# Altium project Humidity_Remover.PrjPcb
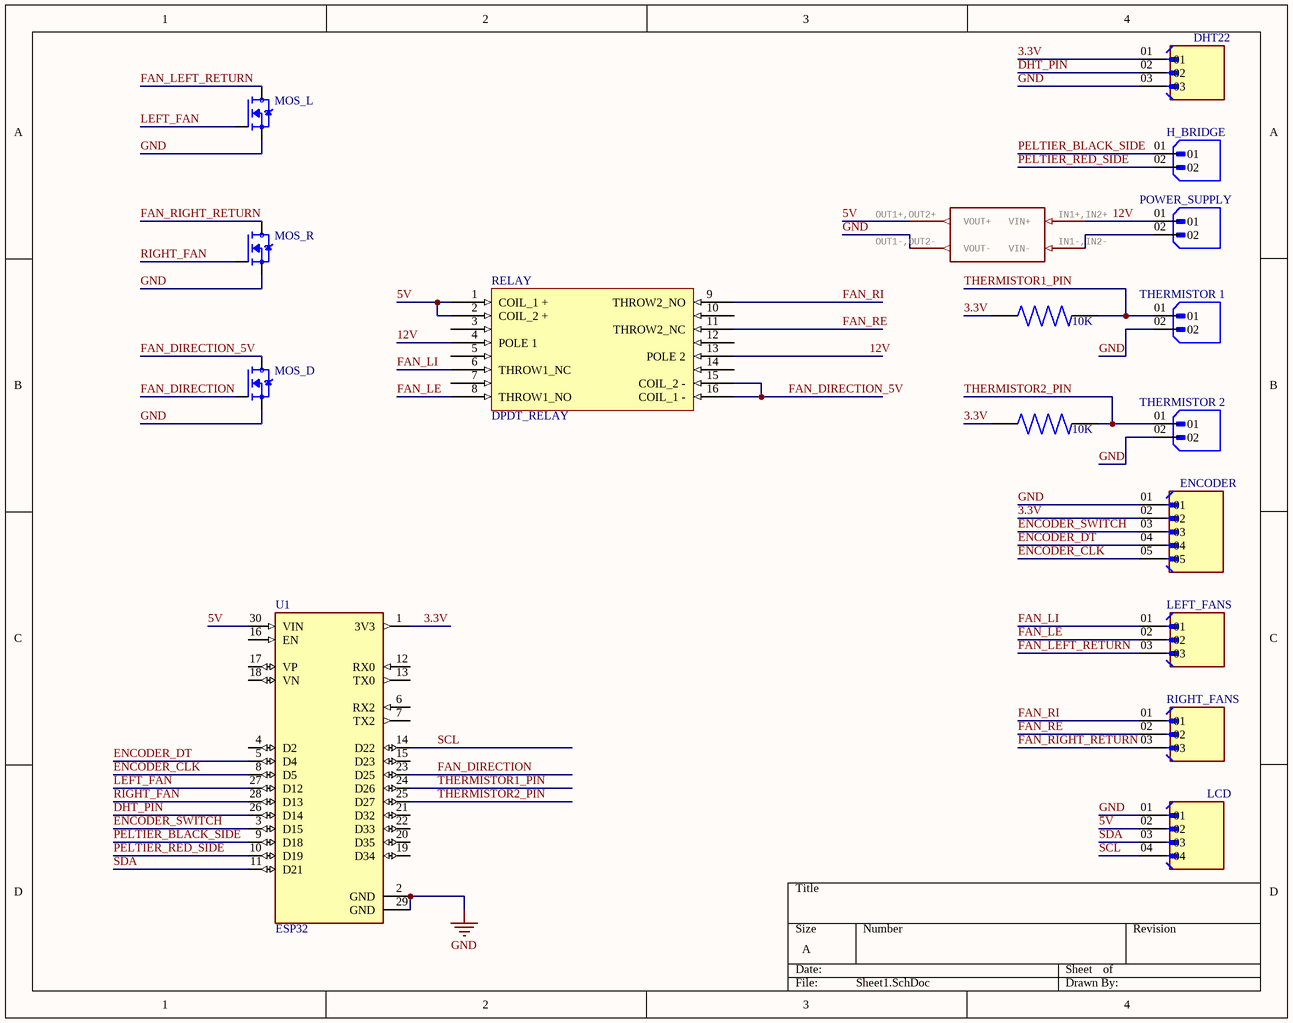
[diagram p0: Sheet1.SchDoc]
1 sheet, 17 parts. Net scope: global (net labels, ports and power ports of the same name join across sheets).

## Sheet Sheet1.SchDoc
size A; SheetNumber: 1; SheetTotal: 1

### Parts
(Parts that share a designator on the sheet are numbered #1, #2 ... from top to bottom, then left to right.)
10K#1  MFR-25FBF52-10K  [RESAD1100W55L680D260]  (value not drawn)
10K#2  10K  [RESAD1100W55L680D260]  (value not drawn)
DHT22  XH250-03S-010  [VALCON_XH250-03S-010]  (value not drawn)
ENCODER  XH250-05S-010  [VALCON_XH250-05S-010]  (value not drawn)
H_BRIDGE  XH250-02S-010  [VALCON_XH250-02S-010]  (value not drawn)
LCD  XH250-04S-010  [VALCON_XH250-04S-010]  (value not drawn)
LEFT_FANS  XH250-03S-010  [VALCON_XH250-03S-010]  (value not drawn)
MOS_D  IRLZ44N  [TO254P1054X469X1930-3]  (value not drawn)
MOS_L  IRLZ44N  [TO254P1054X469X1930-3]  (value not drawn)
MOS_R  IRLZ44N  [TO254P1054X469X1930-3]  (value not drawn)
MP1854  MP1584-dc-brick-pcb Step down Input: 4.5V - 28V Ouput 0.8V - 25V max. 3A Cheap on ebay  [DC-BRICK]  (value not drawn)
POWER_SUPPLY  XH250-02S-010  [VALCON_XH250-02S-010]  (value not drawn)
RELAY  DPDT_RELAY  [RELAY-2S]
RIGHT_FANS  XH250-03S-010  [VALCON_XH250-03S-010]  (value not drawn)
THERMISTOR_1  XH250-02S-010  [VALCON_XH250-02S-010]  (value not drawn)
THERMISTOR_2  XH250-02S-010  [VALCON_XH250-02S-010]  (value not drawn)
U1  ESP32  [MODULE_ESP32_DEVKIT_V1]

### Nets
GND: DHT22.03 ENCODER.01 LCD.01 MOS_D.3(S) MOS_L.3(S) MOS_R.3(S) MP1854.OUT1-,OUT2-(VOUT-) THERMISTOR_1.02 THERMISTOR_2.02 U1.2(GND) U1.29(GND)
3.3V: 10K#1.1 10K#2.1 DHT22.01 ENCODER.02 U1.1(3V3)
5V: LCD.02 MP1854.OUT1+,OUT2+(VOUT+) RELAY.1(COIL_1_+) RELAY.2(COIL_2_+) U1.30(VIN)
12V: MP1854.IN1+,IN2+(VIN+) POWER_SUPPLY.01 RELAY.4(POLE_1) RELAY.13(POLE_2)
DHT_PIN: DHT22.02 U1.26(D14)
ENCODER_CLK: ENCODER.05 U1.8(D5)
ENCODER_DT: ENCODER.04 U1.5(D4)
ENCODER_SWITCH: ENCODER.03 U1.3(D15)
FAN_DIRECTION: MOS_D.1(G) U1.23(D25)
FAN_DIRECTION_5V: MOS_D.2(D) RELAY.15(COIL_2_-) RELAY.16(COIL_1_-)
FAN_LE: LEFT_FANS.02 RELAY.8(THROW1_NO)
FAN_LEFT_RETURN: LEFT_FANS.03 MOS_L.2(D)
FAN_LI: LEFT_FANS.01 RELAY.6(THROW1_NC)
FAN_RE: RELAY.11(THROW2_NC) RIGHT_FANS.02
FAN_RI: RELAY.9(THROW2_NO) RIGHT_FANS.01
FAN_RIGHT_RETURN: MOS_R.2(D) RIGHT_FANS.03
LEFT_FAN: MOS_L.1(G) U1.27(D12)
PELTIER_BLACK_SIDE: H_BRIDGE.01 U1.9(D18)
PELTIER_RED_SIDE: H_BRIDGE.02 U1.10(D19)
RIGHT_FAN: MOS_R.1(G) U1.28(D13)
SCL: LCD.04 U1.14(D22)
SDA: LCD.03 U1.11(D21)
THERMISTOR1_PIN: 10K#1.2 THERMISTOR_1.01 U1.24(D26)
THERMISTOR2_PIN: 10K#2.2 THERMISTOR_2.01 U1.25(D27)
NetMP1854_IN1-,IN2-: MP1854.IN1-,IN2-(VIN-) POWER_SUPPLY.02

Not connected (* = marked no-connect by the designer): RELAY 3 5 7 10 12 14; U1 4(D2) 6(RX2) 7(TX2) 12(RX0) 13(TX0) 15(D23) 16(EN) 17(VP) 18(VN) 19(D34) 20(D35) 21(D32) 22(D33)

### Library data of the parts
10K#1 10K#2 = MFR-25FBF52-10K: 10.2 kOhms Â±1% 0.25W, 1/4W Through Hole Resistor Axial - Metal Film; MF: Yageo; Value: *; SnapEDA_Link: https://www.snapeda.com/parts/MFR-25FBF52-10K/Yageo/view-part/?ref=snap; Availability: In Stock; Price: None; Check_prices: https://www.snapeda.com/parts/MFR-25FBF52-10K/Yageo/view-part/?ref=eda; Purchase-URL: https://pricing.snapeda.com/search/part/MFR-25FBF52-10K/?ref=eda; MP: MFR-25FBF52-10K; Package: Axial Yageo
DHT22 LEFT_FANS RIGHT_FANS = XH250-03S-010: Valcon Wire-to-Board 2.50mm Straight & Right Angle PCB Connectors; SnapEDA_Link: https://www.snapeda.com/parts/XH250-03S-010/Valcon/view-part/?ref=snap; Package: None; Value: *; MF: Valcon; MP: XH250-03S-010; Check_prices: https://www.snapeda.com/parts/XH250-03S-010/Valcon/view-part/?ref=eda
ENCODER = XH250-05S-010: Valcon Wire-to-Board 2.50mm Straight & Right Angle PCB Connectors; SnapEDA_Link: https://www.snapeda.com/parts/XH250-05S-010/Valcon/view-part/?ref=snap; Package: None; Value: *; MF: Valcon; MP: XH250-05S-010; Check_prices: https://www.snapeda.com/parts/XH250-05S-010/Valcon/view-part/?ref=eda
H_BRIDGE POWER_SUPPLY THERMISTOR_1 THERMISTOR_2 = XH250-02S-010: Valcon Wire-to-Board 2.50mm Straight & Right Angle PCB Connectors; SnapEDA_Link: https://www.snapeda.com/parts/XH250-02S-010/Valcon/view-part/?ref=snap; Package: None; Value: *; MF: Valcon; MP: XH250-02S-010; Check_prices: https://www.snapeda.com/parts/XH250-02S-010/Valcon/view-part/?ref=eda
LCD = XH250-04S-010: Valcon Wire-to-Board 2.50mm Straight & Right Angle PCB Connectors; SnapEDA_Link: https://www.snapeda.com/parts/XH250-04S-010/Valcon/view-part/?ref=snap; Package: None; Value: *; MF: Valcon; MP: XH250-04S-010; Check_prices: https://www.snapeda.com/parts/XH250-04S-010/Valcon/view-part/?ref=eda
MOS_D MOS_L MOS_R = IRLZ44N: N-Channel 55 V 47A (Tc) 3.8W (Ta), 110W (Tc) Surface Mount D2PAK; MF: Infineon / IR; Package: TO-220-3 Infineon / IR; Availability: Not in stock; Value: *; MP: IRLZ44N; Check_prices: https://www.snapeda.com/parts/IRLZ44N/Infineon/view-part/?ref=eda; Price: None; SnapEDA_Link: https://www.snapeda.com/parts/IRLZ44N/Infineon/view-part/?ref=snap
MP1854 = MP1584: GateName_1: G$1; SymbolName_1: MP1584; LibraryName: MP1584-dc-brick; DeviceSetName: MP1584; Package: DC-BRICK
U1 = ESP32-DEVKIT-V1: Dual core, Wi-Fi: 2.4 GHz up to 150 Mbits/s,BLE (Bluetooth Low Energy) and legacy Bluetooth, 32 bits, Up to 240 MHz; MF: Do it; Price: None; Availability: Not in stock; Package: None; MP: ESP32-DEVKIT-V1; Value: *; SnapEDA_Link: https://www.snapeda.com/parts/ESP32-DEVKIT-V1/Do+it/view-part/?ref=snap; Check_prices: https://www.snapeda.com/parts/ESP32-DEVKIT-V1/Do+it/view-part/?ref=eda